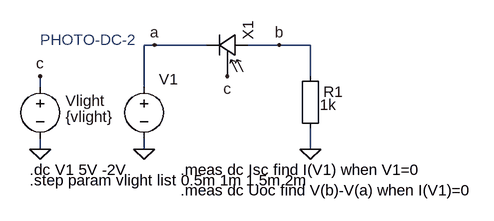
[diagram p0: schematic PHOTO-DC-2.asc]
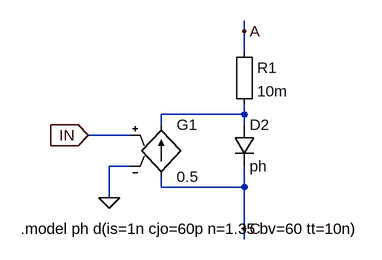
[diagram p1: sub-circuit photodiode.asc]
PHOTO-DC-2.asc, the LTspice schematic file:
Version 4
SHEET 1 880 680
WIRE -64 160 -80 160
WIRE 16 160 -64 160
WIRE 128 160 80 160
WIRE 176 160 128 160
WIRE 176 208 176 160
WIRE -240 224 -240 208
WIRE -80 224 -80 160
WIRE -240 320 -240 304
WIRE -80 320 -80 304
WIRE 176 320 176 288
FLAG -240 320 0
FLAG -80 320 0
FLAG 176 320 0
FLAG 128 160 b
FLAG -64 160 a
FLAG -240 208 c
FLAG 48 208 c
SYMBOL Misc\\EuropeanResistor 160 192 R0
WINDOW 3 31 60 Left 2
SYMATTR Value 1k
SYMATTR InstName R1
SYMBOL voltage -240 208 R0
WINDOW 0 39 38 Left 2
WINDOW 3 39 62 Left 2
WINDOW 123 0 0 Left 2
WINDOW 39 0 0 Left 2
SYMATTR InstName Vlight
SYMATTR Value {vlight}
SYMBOL photodiode 80 176 M270
SYMATTR InstName X1
SYMBOL voltage -80 208 R0
WINDOW 3 24 32 Invisible 2
WINDOW 123 0 0 Left 2
WINDOW 39 0 0 Left 2
WINDOW 0 23 5 Left 2
SYMATTR Value 0
SYMATTR InstName V1
TEXT -256 352 Left 2 !.dc V1 5V -2V
TEXT -256 368 Left 2 !.step param vlight list 0.5m 1m 1.5m 2m
TEXT -24 352 Left 2 !.meas dc Isc find I(V1) when V1=0\n.meas dc Uoc find V(b)-V(a) when I(V1)=0
TEXT -240 152 Left 2 ;PHOTO-DC-2

photodiode.asc, the sub-circuit schematic file:
Version 4
SHEET 1 880 680
WIRE 80 32 80 16
WIRE 80 64 80 32
WIRE 80 160 80 144
WIRE 80 160 -48 160
WIRE -48 176 -48 160
WIRE 80 176 80 160
WIRE -96 192 -160 192
WIRE -96 240 -128 240
WIRE -48 272 -48 256
WIRE 80 272 80 240
WIRE 80 272 -48 272
WIRE -128 288 -128 240
WIRE 80 336 80 272
WIRE 80 352 80 336
FLAG -128 288 0
FLAG 80 32 A
FLAG 80 336 C
FLAG -160 192 IN
IOPIN -160 192 In
SYMBOL Misc\\EuropeanResistor 64 48 R0
SYMATTR InstName R1
SYMATTR Value 10m
SYMBOL g -48 160 R0
SYMATTR InstName G1
SYMATTR Value 0.5
SYMBOL diode 64 176 R0
SYMATTR InstName D2
SYMATTR Value ph
TEXT -264 336 Left 2 !.model ph d(is=1n cjo=60p n=1.35 bv=60 tt=10n)

The netlist it stands for:
* PHOTO-DC-2.asc
R1 b 0 1k
Vlight c 0 {vlight}
XX1 b a c photodiode
V1 a 0 0

* block symbol definitions
.subckt photodiode A C IN
R1 A N001 10m
G1 C N001 IN 0 0.5
D2 N001 C ph
.model ph d(is=1n cjo=60p n=1.35 bv=60 tt=10n)
.ends photodiode

.model D D
.lib standard.dio
.dc V1 5V -2V
.step param vlight list 0.5m 1m 1.5m 2m
.meas dc Isc find I(V1) when V1=0
.meas dc Uoc find V(b)-V(a) when I(V1)=0
* PHOTO-DC-2
.backanno
.end